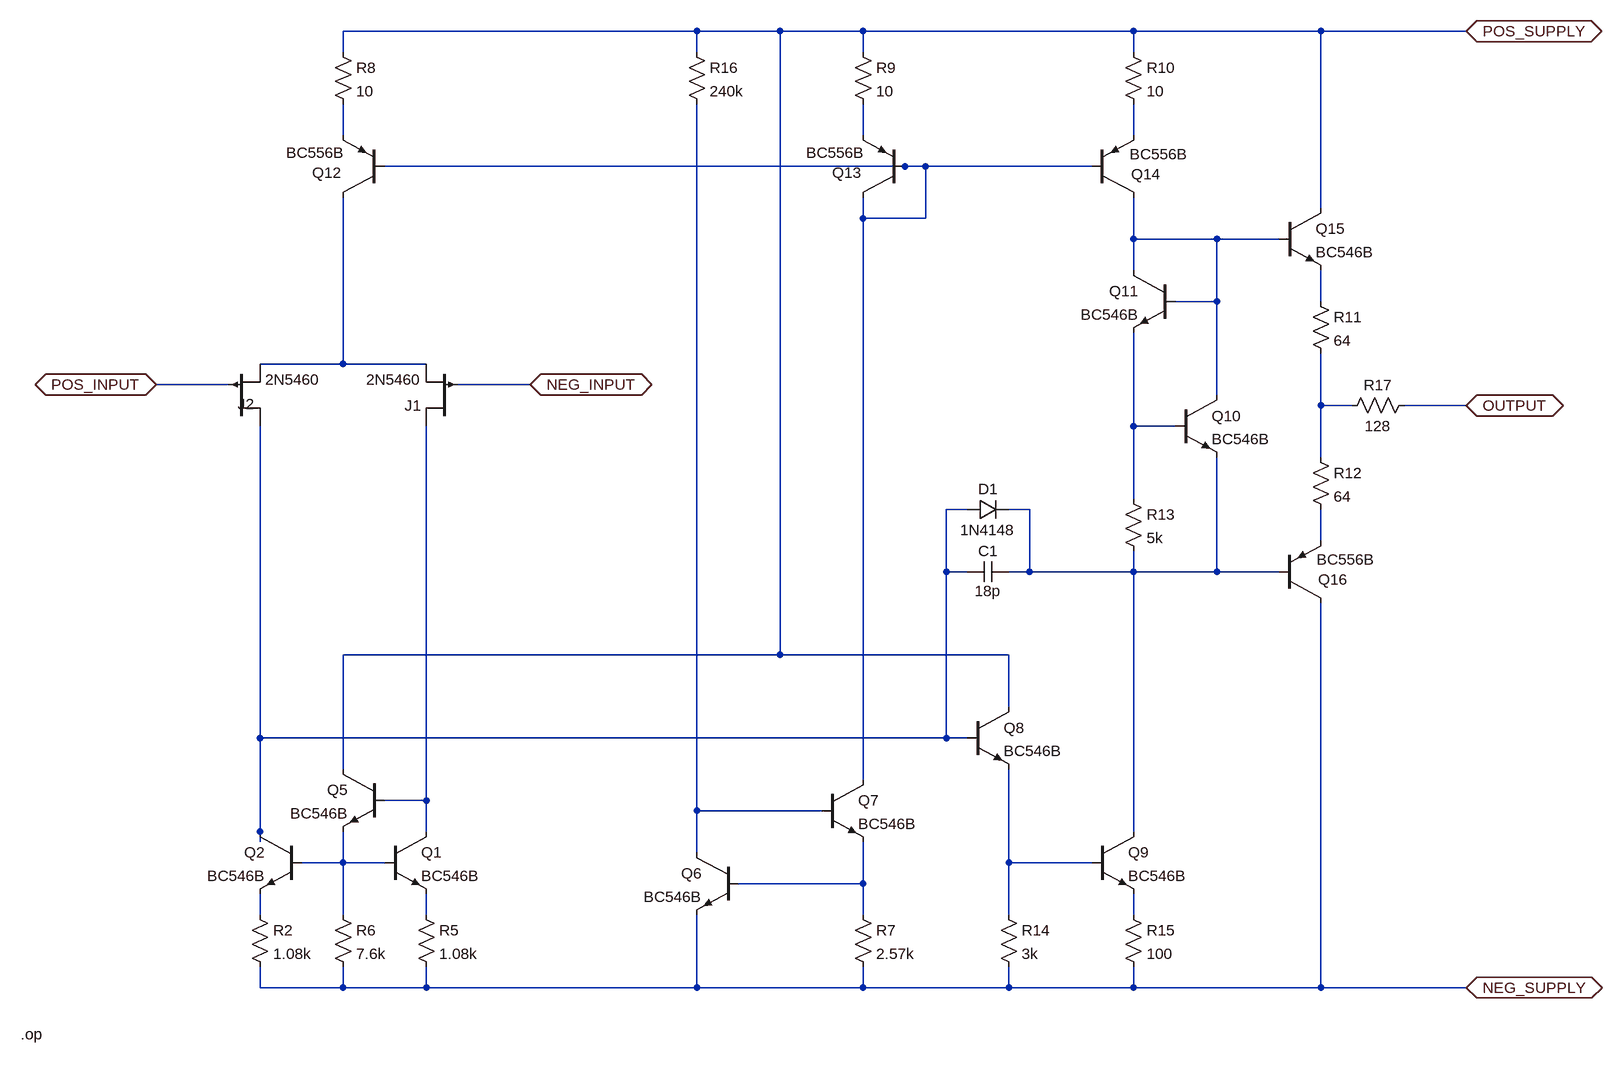
[diagram p0: schematic TL071_discrete.asc]
TL071_discrete.asc, the LTspice schematic file:
Version 4
SHEET 1 880 680
WIRE -4544 -2368 -5088 -2368
WIRE -4416 -2368 -4544 -2368
WIRE -4288 -2368 -4416 -2368
WIRE -3872 -2368 -4288 -2368
WIRE -3584 -2368 -3872 -2368
WIRE -3360 -2368 -3584 -2368
WIRE -5088 -2336 -5088 -2368
WIRE -4544 -2336 -4544 -2368
WIRE -4288 -2336 -4288 -2368
WIRE -3872 -2336 -3872 -2368
WIRE -5088 -2208 -5088 -2256
WIRE -4288 -2208 -4288 -2256
WIRE -3872 -2208 -3872 -2256
WIRE -4224 -2160 -5024 -2160
WIRE -4192 -2160 -4224 -2160
WIRE -3936 -2160 -4192 -2160
WIRE -3584 -2096 -3584 -2368
WIRE -4288 -2080 -4288 -2112
WIRE -4192 -2080 -4192 -2160
WIRE -4192 -2080 -4288 -2080
WIRE -3872 -2048 -3872 -2112
WIRE -3744 -2048 -3872 -2048
WIRE -3648 -2048 -3744 -2048
WIRE -3872 -2000 -3872 -2048
WIRE -3744 -1952 -3744 -2048
WIRE -3744 -1952 -3808 -1952
WIRE -3584 -1952 -3584 -2000
WIRE -5088 -1856 -5088 -2112
WIRE -5088 -1856 -5216 -1856
WIRE -4960 -1856 -5088 -1856
WIRE -5264 -1824 -5376 -1824
WIRE -4800 -1824 -4912 -1824
WIRE -3744 -1808 -3744 -1952
WIRE -3584 -1792 -3584 -1872
WIRE -3536 -1792 -3584 -1792
WIRE -3360 -1792 -3456 -1792
WIRE -3872 -1760 -3872 -1904
WIRE -3808 -1760 -3872 -1760
WIRE -3584 -1712 -3584 -1792
WIRE -3872 -1648 -3872 -1760
WIRE -4128 -1632 -4160 -1632
WIRE -4032 -1632 -4064 -1632
WIRE -3584 -1584 -3584 -1632
WIRE -4160 -1536 -4160 -1632
WIRE -4128 -1536 -4160 -1536
WIRE -4032 -1536 -4032 -1632
WIRE -4032 -1536 -4064 -1536
WIRE -3872 -1536 -3872 -1568
WIRE -3872 -1536 -4032 -1536
WIRE -3744 -1536 -3744 -1712
WIRE -3744 -1536 -3872 -1536
WIRE -3648 -1536 -3744 -1536
WIRE -4416 -1408 -4416 -2368
WIRE -4416 -1408 -5088 -1408
WIRE -4064 -1408 -4416 -1408
WIRE -4064 -1328 -4064 -1408
WIRE -5216 -1280 -5216 -1760
WIRE -4160 -1280 -4160 -1536
WIRE -4160 -1280 -5216 -1280
WIRE -4128 -1280 -4160 -1280
WIRE -5088 -1232 -5088 -1408
WIRE -4288 -1216 -4288 -2080
WIRE -4960 -1184 -4960 -1760
WIRE -4960 -1184 -5024 -1184
WIRE -4544 -1168 -4544 -2256
WIRE -4352 -1168 -4544 -1168
WIRE -5216 -1136 -5216 -1280
WIRE -4960 -1136 -4960 -1184
WIRE -3872 -1136 -3872 -1536
WIRE -5216 -1120 -5216 -1136
WIRE -4544 -1104 -4544 -1168
WIRE -5088 -1088 -5088 -1136
WIRE -5088 -1088 -5152 -1088
WIRE -5024 -1088 -5088 -1088
WIRE -4064 -1088 -4064 -1232
WIRE -3936 -1088 -4064 -1088
WIRE -4288 -1056 -4288 -1120
WIRE -4288 -1056 -4480 -1056
WIRE -5216 -1008 -5216 -1040
WIRE -5088 -1008 -5088 -1088
WIRE -4960 -1008 -4960 -1040
WIRE -4288 -1008 -4288 -1056
WIRE -4064 -1008 -4064 -1088
WIRE -3872 -1008 -3872 -1040
WIRE -5216 -896 -5216 -928
WIRE -5088 -896 -5088 -928
WIRE -5088 -896 -5216 -896
WIRE -4960 -896 -4960 -928
WIRE -4960 -896 -5088 -896
WIRE -4544 -896 -4544 -1008
WIRE -4544 -896 -4960 -896
WIRE -4288 -896 -4288 -928
WIRE -4288 -896 -4544 -896
WIRE -4064 -896 -4064 -928
WIRE -4064 -896 -4288 -896
WIRE -3872 -896 -3872 -928
WIRE -3872 -896 -4064 -896
WIRE -3584 -896 -3584 -1488
WIRE -3584 -896 -3872 -896
WIRE -3360 -896 -3584 -896
FLAG -3360 -896 NEG_SUPPLY
IOPIN -3360 -896 BiDir
FLAG -3360 -1792 OUTPUT
IOPIN -3360 -1792 BiDir
FLAG -3360 -2368 POS_SUPPLY
IOPIN -3360 -2368 BiDir
FLAG -4800 -1824 NEG_INPUT
IOPIN -4800 -1824 BiDir
FLAG -5376 -1824 POS_INPUT
IOPIN -5376 -1824 BiDir
SYMBOL cap -4064 -1552 R90
WINDOW 0 0 32 VBottom 0
WINDOW 3 30 32 VTop 0
SYMATTR InstName C1
SYMATTR Value 18p
SYMBOL npn -5024 -1136 R0
SYMATTR InstName Q1
SYMATTR Value BC546B
SYMBOL npn -5152 -1136 M0
SYMATTR InstName Q2
SYMATTR Value BC546B
SYMBOL diode -4128 -1616 R270
WINDOW 0 32 32 VTop 0
WINDOW 3 0 32 VBottom 0
SYMATTR InstName D1
SYMATTR Value 1N4148
SYMBOL pjf -4912 -1760 R180
SYMATTR InstName J1
SYMATTR Value 2N5460
SYMBOL pjf -5264 -1760 M180
WINDOW 0 14 34 Left 0
SYMATTR InstName J2
SYMATTR Value 2N5460
SYMBOL npn -5024 -1232 M0
SYMATTR InstName Q5
SYMATTR Value BC546B
SYMBOL npn -4480 -1104 M0
SYMATTR InstName Q6
SYMATTR Value BC546B
SYMBOL npn -4352 -1216 R0
SYMATTR InstName Q7
SYMATTR Value BC546B
SYMBOL npn -4128 -1328 R0
SYMATTR InstName Q8
SYMATTR Value BC546B
SYMBOL npn -3936 -1136 R0
SYMATTR InstName Q9
SYMATTR Value BC546B
SYMBOL npn -3808 -1808 R0
SYMATTR InstName Q10
SYMATTR Value BC546B
SYMBOL npn -3808 -2000 M0
SYMATTR InstName Q11
SYMATTR Value BC546B
SYMBOL pnp -5024 -2112 R180
WINDOW 0 66 38 Left 0
WINDOW 3 62 69 Left 0
SYMATTR InstName Q12
SYMATTR Value BC556B
SYMBOL pnp -4224 -2112 R180
WINDOW 0 66 38 Left 0
WINDOW 3 62 69 Left 0
SYMATTR InstName Q13
SYMATTR Value BC556B
SYMBOL pnp -3936 -2112 M180
WINDOW 0 60 36 Left 0
WINDOW 3 58 67 Left 0
SYMATTR InstName Q14
SYMATTR Value BC556B
SYMBOL npn -3648 -2096 R0
SYMATTR InstName Q15
SYMATTR Value BC546B
SYMBOL pnp -3648 -1488 M180
WINDOW 0 60 36 Left 0
WINDOW 3 58 67 Left 0
SYMATTR InstName Q16
SYMATTR Value BC556B
SYMBOL res -5232 -1024 R0
SYMATTR InstName R2
SYMATTR Value 1.08k
SYMBOL res -4976 -1024 R0
SYMATTR InstName R5
SYMATTR Value 1.08k
SYMBOL res -5104 -1024 R0
SYMATTR InstName R6
SYMATTR Value 7.6k
SYMBOL res -4304 -1024 R0
SYMATTR InstName R7
SYMATTR Value 2.57k
SYMBOL res -5104 -2352 R0
SYMATTR InstName R8
SYMATTR Value 10
SYMBOL res -4304 -2352 R0
SYMATTR InstName R9
SYMATTR Value 10
SYMBOL res -3888 -2352 R0
SYMATTR InstName R10
SYMATTR Value 10
SYMBOL res -3600 -1968 R0
SYMATTR InstName R11
SYMATTR Value 64
SYMBOL res -3600 -1728 R0
SYMATTR InstName R12
SYMATTR Value 64
SYMBOL res -3888 -1664 R0
SYMATTR InstName R13
SYMATTR Value 5k
SYMBOL res -4080 -1024 R0
SYMATTR InstName R14
SYMATTR Value 3k
SYMBOL res -3888 -1024 R0
SYMATTR InstName R15
SYMATTR Value 100
SYMBOL res -4560 -2352 R0
SYMATTR InstName R16
SYMATTR Value 240k
SYMBOL res -3440 -1808 R90
WINDOW 0 0 56 VBottom 0
WINDOW 3 32 56 VTop 0
SYMATTR InstName R17
SYMATTR Value 128
TEXT -5584 -824 Left 0 !.op

The netlist it stands for:
* TL071_discrete.asc
C1 N011 N010 18p
Q1 N013 N015 N019 0 BC546B
Q2 N010 N015 N018 0 BC546B
D1 N010 N011 1N4148
J1 N013 NEG_INPUT N007 2N5460
J2 N010 POS_INPUT N007 2N5460
Q5 POS_SUPPLY N013 N015 0 BC546B
Q6 N014 N017 NEG_SUPPLY 0 BC546B
Q7 N004 N014 N017 0 BC546B
Q8 POS_SUPPLY N010 N016 0 BC546B
Q9 N011 N016 N020 0 BC546B
Q10 N005 N009 N011 0 BC546B
Q11 N005 N005 N009 0 BC546B
Q12 N007 N004 N001 0 BC556B
Q13 N004 N004 N002 0 BC556B
Q14 N005 N004 N003 0 BC556B
Q15 POS_SUPPLY N005 N006 0 BC546B
Q16 NEG_SUPPLY N011 N012 0 BC556B
R2 N018 NEG_SUPPLY 1.08k
R5 N019 NEG_SUPPLY 1.08k
R6 N015 NEG_SUPPLY 7.6k
R7 N017 NEG_SUPPLY 2.57k
R8 POS_SUPPLY N001 10
R9 POS_SUPPLY N002 10
R10 POS_SUPPLY N003 10
R11 N006 N008 64
R12 N008 N012 64
R13 N009 N011 5k
R14 N016 NEG_SUPPLY 3k
R15 N020 NEG_SUPPLY 100
R16 POS_SUPPLY N014 240k
R17 OUTPUT N008 128
.model D D
.lib standard.dio
.model NPN NPN
.model PNP PNP
.lib standard.bjt
.model NJF NJF
.model PJF PJF
.lib standard.jft
.op
.backanno
.end